# Altium schematic sheet OPAMP_TESTER_1.SchDoc: OPAMP_TESTER
size A4; CheckedBy: D.MOHAMMADI; DrawnBy: A.RAJABI; SheetNumber: 2; SheetTotal: 3
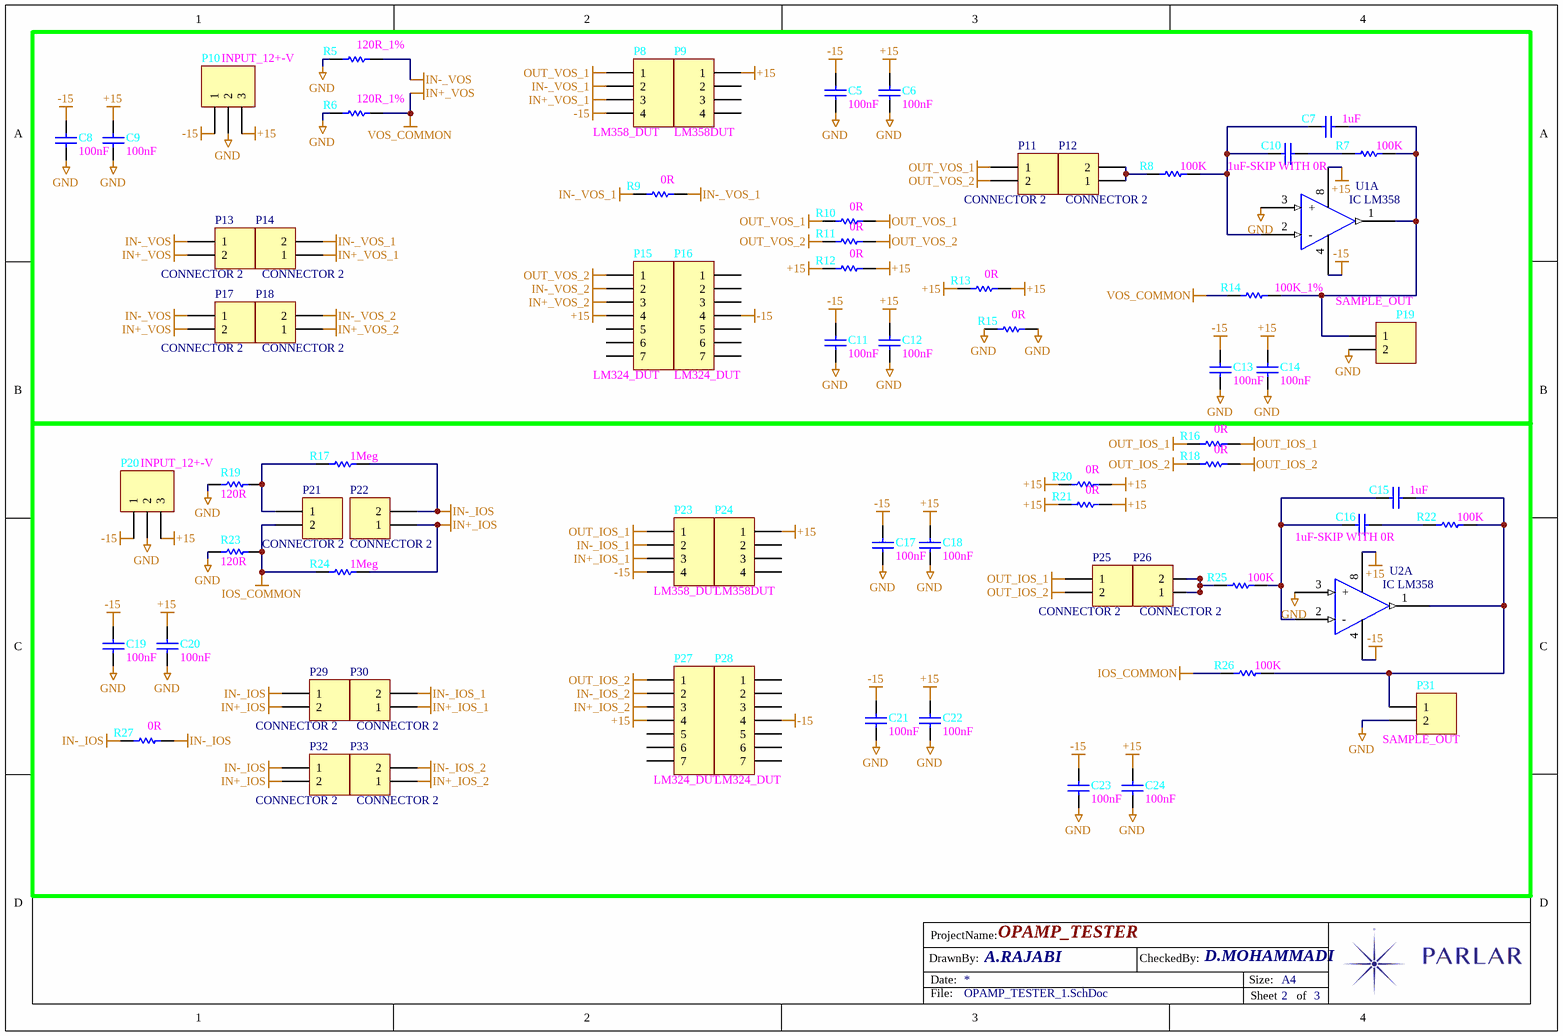
[diagram p0: OPAMP_TESTER_1.SchDoc]

## Parts
C5  100nF  [SMD 0805]
C6  100nF  [SMD 1206]
C7  1uF  [SMD 0805]
C8  100nF  [SMD 0805]
C9  100nF  [SMD 0805]
C10  1uF-SKIP WITH 0R  [SMD 0805]
C11  100nF  [SMD 0805]
C12  100nF  [SMD 1206]
C13  100nF  [SMD 0805]
C14  100nF  [SMD 0805]
C15  1uF  [SMD 1206]
C16  1uF-SKIP WITH 0R  [SMD 1206]
C17  100nF  [SMD 0805]
C18  100nF  [SMD 1206]
C19  100nF  [SMD 0805]
C20  100nF  [SMD 0805]
C21  100nF  [SMD 1206]
C22  100nF  [SMD 0805]
C23  100nF  [SMD 0805]
C24  100nF  [SMD 0805]
P8  LM358_DUT  [CON HDR 2.54FM 4]
P9  LM358DUT  [CON HDR 2.54FM 4]
P10  INPUT_12+-V  [CON XH 3]
P11  CONNECTOR 2  [CON HDR 2.54M 2]
P12  CONNECTOR 2  [CON HDR 2.54M 2]
P13  CONNECTOR 2  [CON HDR 2.54M 2]
P14  CONNECTOR 2  [CON HDR 2.54M 2]
P15  LM324_DUT  [CON HDR 2.54FM 7]
P16  LM324_DUT  [CON HDR 2.54FM 7]
P17  CONNECTOR 2  [CON HDR 2.54M 2]
P18  CONNECTOR 2  [CON HDR 2.54M 2]
P19  SAMPLE_OUT  [CON XH 2]
P20  INPUT_12+-V  [CON XH 3]
P21  CONNECTOR 2  [CON HDR 2.54M 2]
P22  CONNECTOR 2  [CON HDR 2.54M 2]
P23  LM358_DUT  [CON HDR 2.54FM 4]
P24  LM358DUT  [CON HDR 2.54FM 4]
P25  CONNECTOR 2  [CON HDR 2.54M 2]
P26  CONNECTOR 2  [CON HDR 2.54M 2]
P27  LM324_DUT  [CON HDR 2.54FM 7]
P28  LM324_DUT  [CON HDR 2.54FM 7]
P29  CONNECTOR 2  [CON HDR 2.54M 2]
P30  CONNECTOR 2  [CON HDR 2.54M 2]
P31  SAMPLE_OUT  [CON XH 2]
P32  CONNECTOR 2  [CON HDR 2.54M 2]
P33  CONNECTOR 2  [CON HDR 2.54M 2]
R5  120R_1%  [SMD 1206]
R6  120R_1%  [SMD 0805]
R7  100K  [SMD 0805]
R8  100K  [SMD 1206]
R9  0R  [SMD 1206]
R10  0R  [SMD 1206]
R11  0R  [SMD 1206]
R12  0R  [SMD 1206]
R13  0R  [SMD 1206]
R14  100K_1%  [SMD 1206]
R15  0R  [SMD 1206]
R16  0R  [SMD 1206]
R17  1Meg  [SMD 0805]
R18  0R  [SMD 1206]
R19  120R  [SMD 0805]
R20  0R  [SMD 1206]
R21  0R  [SMD 1206]
R22  100K  [SMD 0805]
R23  120R  [SMD 0805]
R24  1Meg  [SMD 0805]
R25  100K  [SMD 1206]
R26  100K  [SMD 0805]
R27  0R  [SMD 1206]
U1  IC LM358  [SMD IC SOP8]  (part A of 2)
U2  IC LM358  [SMD IC SOP8]  (part A of 2)

## Nets
+15: C6.2 C9.2 C12.2 C14.2 C18.2 C20.2 C22.2 C24.2 P9.1 P10.3 P15.4 P20.3 P24.1 P27.4 R12.1 R12.2 R13.1 R13.2 R20.1 R20.2 R21.1 R21.2 U1.8(VCC) U2.8(VCC)
-15: C5.2 C8.2 C11.2 C13.2 C17.2 C19.2 C21.2 C23.2 P8.4 P10.1 P16.4 P20.1 P23.4 P28.4 U1.4(GND) U2.4(GND)
GND: C5.1 C6.1 C8.1 C9.1 C11.1 C12.1 C13.1 C14.1 C17.1 C18.1 C19.1 C20.1 C21.1 C22.1 C23.1 C24.1 P10.2 P19.2 P20.2 P31.2 R5.1 R6.1 R15.1 R15.2 R19.1 R23.1 U1.3(+) U2.3(+)
IN+_IOS: P22.1 P29.2 P32.2 R24.2
IN+_IOS_1: P23.3 P30.1
IN+_IOS_2: P27.3 P33.1
IN+_VOS: P13.2 P17.2 R6.2 R14.1  [also labelled VOS_COMMON]
IN+_VOS_1: P8.3 P14.1
IN+_VOS_2: P15.3 P18.1
IN-_IOS: P22.2 P29.1 P32.1 R17.2 R27.1 R27.2
IN-_IOS_1: P23.2 P30.2
IN-_IOS_2: P27.2 P33.2
IN-_VOS: P13.1 P17.1 R5.2
IN-_VOS_1: P8.2 P14.2 R9.1 R9.2
IN-_VOS_2: P15.2 P18.2
IOS_COMMON: P21.2 R23.2 R24.1 R26.1
OUT_IOS_1: P23.1 P25.1 R16.1 R16.2
OUT_IOS_2: P25.2 P27.1 R18.1 R18.2
OUT_VOS_1: P8.1 P11.1 R10.1 R10.2
OUT_VOS_2: P11.2 P15.1 R11.1 R11.2
NetC7_1: C7.1 P19.1 R7.2 R14.2 U1.1(OUT1)
NetC7_2: C7.2 C10.2 R8.2 U1.2(-)
NetC10_1: C10.1 R7.1
NetC15_1: C15.1 P31.1 R22.2 R26.2 U2.1(OUT1)
NetC15_2: C15.2 C16.2 R25.2 U2.2(-)
NetC16_1: C16.1 R22.1
NetP12_1: P12.1 P12.2 R8.1
NetP21_1: P21.1 R17.1 R19.2
NetP26_1: P26.1 P26.2 R25.1

Not connected (* = marked no-connect by the designer): P9 2 3 4; P15 5 6 7; P16 1 2 3 5 6 7; P24 2 3 4; P27 5 6 7; P28 1 2 3 5 6 7

## Notes on the sheet
- DrawnBy:
- ProjectName:
- Date:
- CheckedBy:
- Size:
- A4
- File:
- Sheet
- of

## Library data of the parts
C5-C24 = CAP: Capacitor; Published: 8-Jun-2000; LatestRevisionDate: 17-Jul-2002; LatestRevisionNote: Re-released for DXP Platform.; PackageReference: RAD-0.3; Publisher: Altium Limited; PackageDescription: Radial Cap, Thru-Hole; 2 Leads; 0.3 in Pin Spacing
P8 P9 P23 P24 = CONNECTOR 4: Header, 4-Pin; LatestRevisionDate: 17-Jul-2002; LatestRevisionNote: Re-released for DXP Platform.; Publisher: Altium Limited
P10 P20 = CONNECTOR 3: Header, 3-Pin; LatestRevisionDate: 17-Jul-2002; LatestRevisionNote: Re-released for DXP Platform.; Publisher: Altium Limited
P11-P14 P17-P19 P21 P22 P25 P26 P29-P33 = CONNECTOR 2: Header, 2-Pin; LatestRevisionDate: 17-Jul-2002; LatestRevisionNote: Re-released for DXP Platform.; Publisher: Altium Limited
P15 P16 P27 P28 = CONNECTOR 7: Header, 7-Pin; LatestRevisionDate: 17-Jul-2002; LatestRevisionNote: Re-released for DXP Platform.; Publisher: Altium Limited
R5-R27 = RES: Resistor